# Altium schematic sheet Charger_BQ25713.SchDoc: Mynd-Charger
size A3; PageSetup: Record=PageOptions|CenterHorizontal=True|CenterVertical=True|PrintScale=0.71|XCorrection=1.00|YCorrection=1.00|PrintKind=0|BorderSize=5000000|LeftOffset=0|BottomOffset=0|Orientation=2|PaperLength=1000|PaperWidth=1000|Scale=100|PaperSource=7|PrintQuality=-3|MediaType=1|DitherType=10|PrintScaleMode=1|PaperKind=A4|PaperIndex=9; SheetNumber: 3; SheetTotal: 6
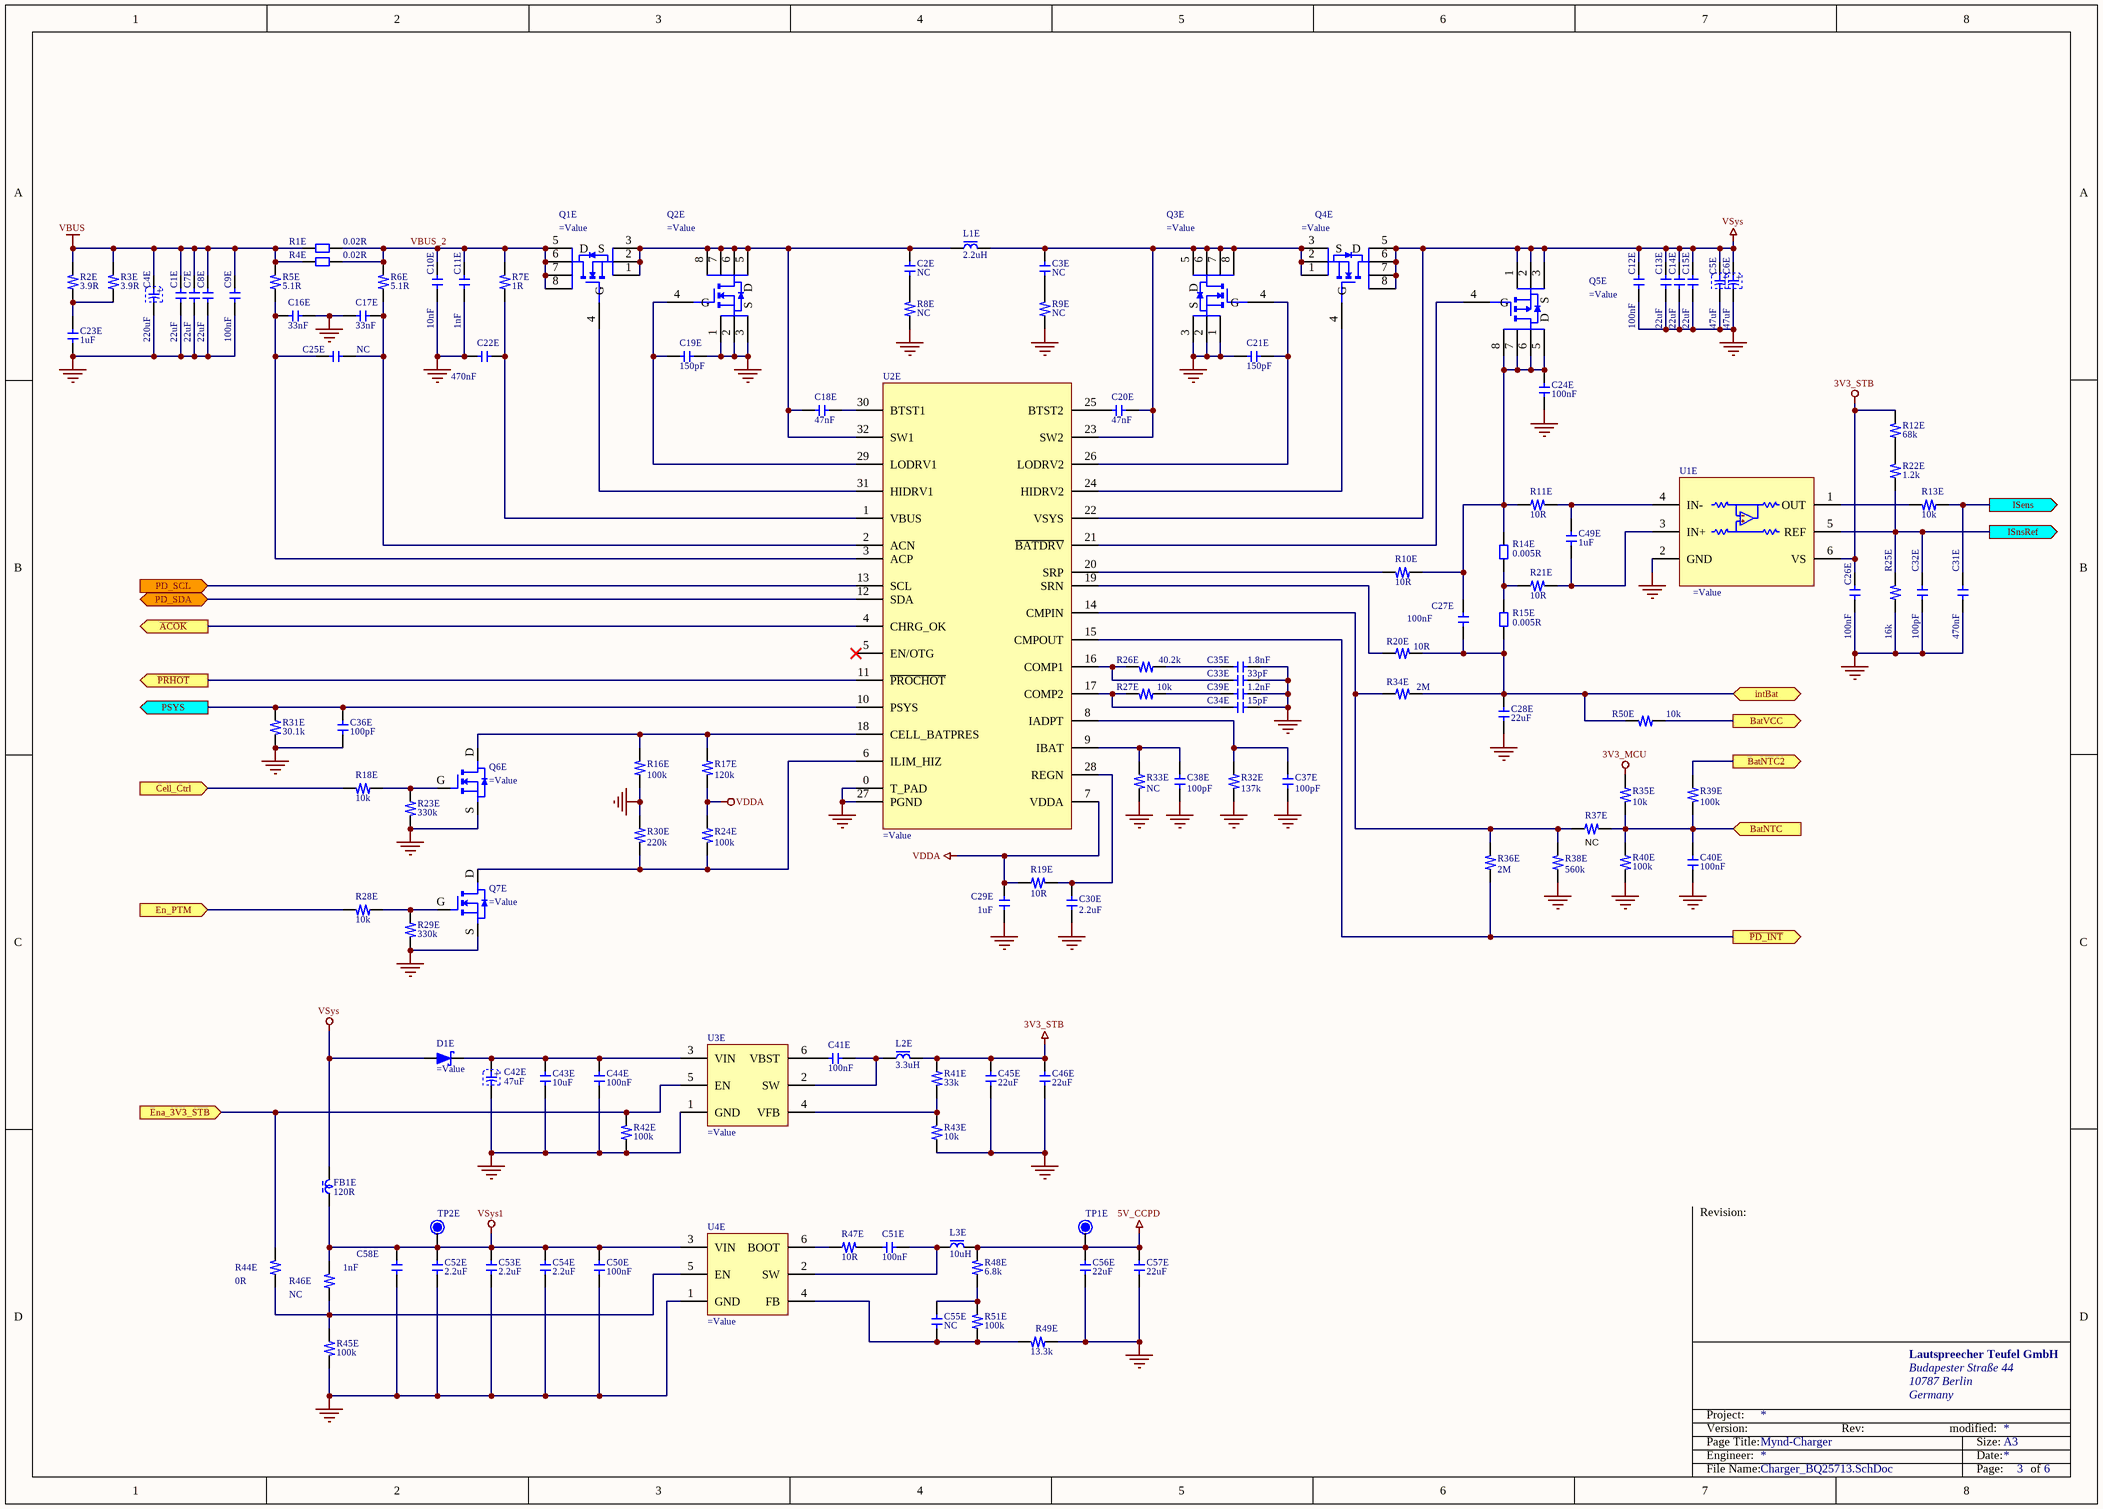
[diagram p0: Charger_BQ25713.SchDoc]

## Parts
C1E  22uF  [C1206]
C2E  NC  [C0603X80]
C3E  NC  [C0603X80]
C4E  220uF  [ECAP_SMD_800X1000]
C5E  47uF  [ECAP_SMD_630X540]
C6E  47uF  [ECAP_SMD_630X540]
C7E  22uF  [C1206]
C8E  22uF  [C1206]
C9E  100nF  [C0603X100]
C10E  10nF  [C0603X100]
C11E  1nF  [C0603X100]
C12E  100nF  [C0603X100]
C13E  22uF  [C1206]
C14E  22uF  [C1206]
C15E  22uF  [C1206]
C16E  33nF  [C0603X100]
C17E  33nF  [C0603X100]
C18E  47nF  [C0603X100]
C19E  150pF  [C0603X80]
C20E  47nF  [C0603X100]
C21E  150pF  [C0603X80]
C22E  470nF  [C0603X100]
C23E  1uF  [C0805_145]
C24E  100nF  [C0603X100]
C25E  NC  [C0603X100]
C26E  100nF  [C0603X100]
C27E  100nF  [C0603X100]
C28E  22uF  [C1206]
C29E  1uF  [C0603X105]
C30E  2.2uF  [C0603X105]
C31E  470nF  [C0603X100]
C32E  100pF  [C0603X80]
C33E  33pF  [C0603X80]
C34E  15pF  [C0603X80]
C35E  1.8nF  [C0603X100]
C36E  100pF  [C0603X80]
C37E  100pF  [C0603X80]
C38E  100pF  [C0603X80]
C39E  1.2nF  [C0402]
C40E  100nF  [C0603X100]
C41E  100nF  [C0603X100]
C42E  47uF  [ECAP_SMD_630X540]
C43E  10uF  [C1206]
C44E  100nF  [C0603X100]
C45E  22uF  [C0805_145]
C46E  22uF  [C0805_145]
C49E  1uF  [C0603X105]
C50E  100nF  [C0603X100]
C51E  100nF  [C0603X100]
C52E  2.2uF  [C0805_145]
C53E  2.2uF  [C0805_145]
C54E  2.2uF  [C0805_145]
C55E  NC  [C0603X80]
C56E  22uF  [C0805_145]
C57E  22uF  [C0805_145]
C58E  1nF  [C0603X105]
D1E  (no value)  [SOD-123]
FB1E  120R  [L0805]
L1E  2.2uH  [IND_SMD_YT_SQU_L118XW108XH40_A]
L2E  3.3uH  [IND_SMD_SQU_L60XW60XH20]
L3E  10uH  [IND_SMD_YT_SQU_L78XW70XH30]
Q1E  (no value)  [DFN8_500X600X100_127_A]
Q2E  (no value)  [DFN8_500X600X100_127_A]
Q3E  (no value)  [DFN8_500X600X100_127_A]
Q4E  (no value)  [DFN8_500X600X100_127_A]
Q5E  (no value)  [DFN8_500X600X100_127_A]
Q6E  (no value)  [SOT23-GSD]
Q7E  (no value)  [SOT23-GSD]
R1E  0.02R  [R1206]
R2E  3.9R  [R0805]
R3E  3.9R  [R0805]
R4E  0.02R  [R1206]
R5E  5.1R  [R0603]
R6E  5.1R  [R0603]
R7E  1R  [R0603]
R8E  NC  [R0805]
R9E  NC  [R0805]
R10E  10R  [R0603]
R11E  10R  [R0603]
R12E  68k  [R0603]
R13E  10k  [R0603]
R14E  0.005R  [R1206]
R15E  0.005R  [R1206]
R16E  100k  [R0603]
R17E  120k  [R0603]
R18E  10k  [R0603]
R19E  10R  [R0603]
R20E  10R  [R0603]
R21E  10R  [R0603]
R22E  1.2k  [R0603]
R23E  330k  [R0603]
R24E  100k  [R0603]
R25E  16k  [R0603]
R26E  40.2k  [R0603]
R27E  10k  [R0603]
R28E  10k  [R0603]
R29E  330k  [R0603]
R30E  220k  [R0603]
R31E  30.1k  [R0603]
R32E  137k  [R0603]
R33E  NC  [R0603]
R34E  2M  [R0603]
R35E  10k  [R0603]
R36E  2M  [R0603]
R37E  100k  [R0603]  (value not drawn)
R38E  560k  [R0603]
R39E  100k  [R0603]
R40E  100k  [R0603]
R41E  33k  [R0603]
R42E  100k  [R0603]
R43E  10k  [R0603]
R44E  0R  [R0603]
R45E  100k  [R0603]
R46E  NC  [R0603]
R47E  10R  [R0603]
R48E  6.8k  [R0603]
R49E  13.3k  [R0603]
R50E  10k  [R0603]
R51E  100k  [R0603]
TP1E  TP_T_60_40  [TP_T_60_40]  (value not drawn)  (no BOM)
TP2E  TP_T_60_40  [TP_T_60_40]  (value not drawn)  (no BOM)
U1E  (no value)  [SOT23_6_SC74]
U2E  (no value)  [QFN32_400X400X80_40_P280X280]
U3E  (no value)  [SOT23_6_SC74]
U4E  (no value)  [SOT23_6_SC74]

## Ports
BatNTC2 (out), BatNTC (in), BatVCC (out), Cell_Ctrl (in), En_PTM (in), Ena_3V3_STB (in), intBat (bidir), ISens (out), ISnsRef (out), PD_SCL (in), PD_SDA (bidir), PSYS (out), ~{ACOK} (out), ~{PD_INT} (out), ~{PRHOT} (out)

## Nets
3V3_MCU: R35E.2
3V3_STB: C26E.2 C45E.1 C46E.1 L2E.2 R12E.2 R41E.2 U1E.6(VS)
5V_CCPD: C56E.1 C57E.1 L3E.2 R48E.1 TP1E.1
GND: C1E.2 C4E.2 C5E.2 C6E.2 C7E.1 C8E.1 C9E.2 C10E.1 C11E.2 C12E.1 C13E.1 C14E.1 C15E.1 C16E.1 C17E.1 C19E.1 C21E.2 C22E.1 C23E.2 C24E.2 C26E.1 C28E.2 C29E.2 C30E.2 C31E.1 C32E.1 C33E.1 C34E.1 C35E.1 C36E.2 C37E.2 C38E.2 C39E.2 C40E.1 C42E.2 C43E.2 C44E.2 C45E.2 C46E.2 C50E.2 C52E.2 C53E.2 C54E.2 C56E.2 C57E.2 C58E.2 Q2E.1(S) Q2E.2(S) Q2E.3(S) Q3E.1(S) Q3E.2(S) Q3E.3(S) Q6E.S Q7E.S R8E.2 R9E.2 R16E.2 R23E.1 R25E.1 R29E.1 R30E.2 R31E.1 R32E.1 R33E.1 R38E.2 R40E.1 R42E.2 R43E.2 R45E.1 R49E.2 U1E.2(GND) U2E.0(T_PAD) U2E.27(PGND) U3E.1(GND) U4E.1(GND)
VBUS: C1E.1 C4E.1 C7E.2 C8E.2 C9E.1 R1E.1 R2E.1 R3E.1 R4E.1 R5E.1
VDDA: C29E.1 R17E.2 R19E.2 R24E.1 U2E.7(VDDA)
VSys: C5E.1 C6E.1 C12E.2 C13E.2 C14E.2 C15E.2 D1E.A FB1E.1 Q4E.5(D) Q4E.6(D) Q4E.7(D) Q4E.8(D) Q5E.1(S) Q5E.2(S) Q5E.3(S) U2E.22(VSYS)
VSys1: C50E.1 C52E.1 C53E.1 C54E.1 C58E.1 FB1E.2 R46E.1 TP2E.1 U4E.3(VIN)
~{ACOK}: U2E.4(CHRG_OK) ; port ~{ACOK}
~{PD_INT}: R36E.2 U2E.15(CMPOUT) ; port ~{PD_INT}
~{PRHOT}: U2E.11(~{PROCHOT}) ; port ~{PRHOT}
BatNTC: C40E.2 R35E.1 R37E.1 R39E.1 R40E.2 ; port BatNTC
BatNTC2: R39E.2 ; port BatNTC2
BatVCC: R50E.2 ; port BatVCC
Cell_Ctrl: R18E.1 ; port Cell_Ctrl
En_PTM: R28E.1 ; port En_PTM
Ena_3V3_STB: R42E.1 R44E.1 U3E.5(EN) ; port Ena_3V3_STB
intBat: C27E.2 C28E.1 R15E.1 R20E.1 R34E.1 R50E.1 ; port intBat
ISens: C31E.2 R13E.1 ; port ISens
ISnsRef: C32E.2 R22E.1 R25E.2 U1E.5(REF) ; port ISnsRef
PD_SCL: U2E.13(SCL) ; port PD_SCL
PD_SDA: U2E.12(SDA) ; port PD_SDA
PSYS: C36E.1 R31E.2 U2E.10(PSYS) ; port PSYS
VBUS_2: C10E.2 C11E.1 Q1E.5(D) Q1E.6(D) Q1E.7(D) Q1E.8(D) R1E.2 R4E.2 R6E.1 R7E.1
NetC2E_1: C2E.1 R8E.1
NetC2E_2: C2E.2 C18E.1 L1E.1 Q1E.1(S) Q1E.2(S) Q1E.3(S) Q2E.5(D) Q2E.6(D) Q2E.7(D) Q2E.8(D) U2E.32(SW1)
NetC3E_1: C3E.1 R9E.1
NetC3E_2: C3E.2 C20E.2 L1E.2 Q3E.5(D) Q3E.6(D) Q3E.7(D) Q3E.8(D) Q4E.1(S) Q4E.2(S) Q4E.3(S) U2E.23(SW2)
NetC16E_2: C16E.2 C25E.1 R5E.2 U2E.3(ACP)
NetC17E_2: C17E.2 C25E.2 R6E.2 U2E.2(ACN)
NetC18E_2: C18E.2 U2E.30(BTST1)
NetC19E_2: C19E.2 Q2E.4(G) U2E.29(LODRV1)
NetC20E_1: C20E.1 U2E.25(BTST2)
NetC21E_1: C21E.1 Q3E.4(G) U2E.26(LODRV2)
NetC22E_2: C22E.2 R7E.2 U2E.1(VBUS)
NetC23E_1: C23E.1 R2E.2 R3E.2
NetC24E_1: C24E.1 C27E.1 Q5E.5(D) Q5E.6(D) Q5E.7(D) Q5E.8(D) R10E.2 R11E.1 R14E.2
NetC30E_1: C30E.1 R19E.1 U2E.28(REGN)
NetC33E_2: C33E.2 R26E.2 U2E.16(COMP1)
NetC34E_2: C34E.2 R27E.1 U2E.17(COMP2)
NetC35E_2: C35E.2 R26E.1
NetC37E_1: C37E.1 R32E.2 U2E.8(IADPT)
NetC38E_1: C38E.1 R33E.2 U2E.9(IBAT)
NetC39E_1: C39E.1 R27E.2
NetC41E_1: C41E.1 U3E.6(VBST)
NetC41E_2: C41E.2 L2E.1 U3E.2(SW)
NetC42E_1: C42E.1 C43E.1 C44E.1 D1E.K U3E.3(VIN)
NetC49E_1: C49E.1 R11E.2 U1E.4(IN-)
NetC49E_2: C49E.2 R21E.1 U1E.3(IN+)
NetC51E_1: C51E.1 L3E.1 U4E.2(SW)
NetC51E_2: C51E.2 R47E.1
NetC55E_1: C55E.1 R48E.2 R51E.1
NetC55E_2: C55E.2 R49E.1 R51E.2 U4E.4(FB)
NetQ1E_4: Q1E.4(G) U2E.31(HIDRV1)
NetQ4E_4: Q4E.4(G) U2E.24(HIDRV2)
NetQ5E_4: Q5E.4(G) U2E.21(~{BATDRV})
NetQ6E_D: Q6E.D R16E.1 R17E.1 U2E.18(CELL_BATPRES)
NetQ6E_G: Q6E.G R18E.2 R23E.2
NetQ7E_D: Q7E.D R24E.2 R30E.1 U2E.6(ILIM_HIZ)
NetQ7E_G: Q7E.G R28E.2 R29E.2
NetR10E_1: R10E.1 U2E.20(SRP)
NetR12E_1: R12E.1 R22E.2
NetR13E_2: R13E.2 U1E.1(OUT)
NetR14E_1: R14E.1 R15E.2 R21E.2
NetR20E_2: R20E.2 U2E.19(SRN)
NetR34E_2: R34E.2 R36E.1 R37E.2 R38E.1 U2E.14(CMPIN)
NetR41E_1: R41E.1 R43E.1 U3E.4(VFB)
NetR44E_2: R44E.2 R45E.2 R46E.2 U4E.5(EN)
NetR47E_2: R47E.2 U4E.6(BOOT)

Not connected (* = marked no-connect by the designer): U2E 5(EN/OTG)*

## Notes on the sheet
- (near R37E) NC
- Revision:
- Lautspreecher Teufel GmbH
- Budapester Straße 44
- 10787 Berlin
- Germany
- Page Title:
- Engineer:
- Project:
- Version:
- Rev:
- modified:
- Date:
- Size:
- A3
- File Name:
- Page:
- of
- (in symbol P-001-0142-39) +
- (in symbol P-001-0307-14) +
- (in symbol P-001-0307-15) +

## Library data of the parts
C1E C7E C8E C13E C14E C15E C28E = P-001-0195-15: PSHF SMD M CAP 22uF 25V ±20% 1206 X5R; Manufacturer: Multi Sourced; Part_Number: Generic; Part_Type: Capacitor ceramic SMT; Tolerance: ±20%; TemperatureRange: X5R; Value: 22uF; Temp_Coefficient: X5R; Voltage: 25V
C2E C3E = P-001-0381-16: PSHF SMD M CAP 30pF 50V ±5% 0603 NPO; Manufacturer: Multi Sourced; Part_Number: Generic; Part_Type: Capacitor ceramic SMT; Tolerance: ±5%; TemperatureRange: NPO; Value: NC; Temp_Coefficient: NPO; Voltage: 50V
C4E = P-001-0142-39: PS SMD COND ELECT 220uF 35V ±20% 105℃; Manufacturer: Multi-Sourced; Part_Number: Generic; Part_Type: Capacitor electrolytic SMT; Tolerance: ±20%; TemperatureRange: 105℃; Value: 220uF; Voltage: 35V
C5E C6E = P-001-0307-14: PS SMD COND ELECT 47uF 35V ±20% 105℃; Manufacturer: Multi-Sourced; Part_Number: Generic; Part_Type: Capacitor electrolytic SMT; Tolerance: ±20%; TemperatureRange: 105℃; Value: 47uF; Voltage: 35V
C9E C12E C24E C26E C27E C40E C41E C44E C50E C51E = P-001-0074-61: PSHF SMD M CAP 100nF 50V ±10% 0603 X7R; Manufacturer: Multi Sourced; Part_Number: Generic; Part_Type: Capacitor ceramic SMT; Tolerance: ±10%; TemperatureRange: X7R; Value: 100nF; Temp_Coefficient: X7R; Voltage: 50V
C10E C25E = P-001-0058-45: PSHF SMD M CAP 10nF 50V ±10% 0603 X7R; Manufacturer: Multi Sourced; Part_Number: Generic; Part_Type: Capacitor ceramic SMT; Tolerance: ±10%; TemperatureRange: X7R; Temp_Coefficient: X7R; Voltage: 50V
  C10E: Value: 10nF
  C25E: Value: NC
C11E = P-001-0073-48: PSHF SMD M CAP 1nF 50V ±10% 0603 X7R; Manufacturer: Multi Sourced; Part_Number: Generic; Part_Type: Capacitor ceramic SMT; Tolerance: ±10%; TemperatureRange: X7R; Value: 1nF; Temp_Coefficient: X7R; Voltage: 50V
C16E C17E = P-001-0095-32: PSHF SMD M CAP 33nF 50V ±10% 0603 X7R; Manufacturer: Multi Sourced; Part_Number: Generic; Part_Type: Capacitor ceramic SMT; Tolerance: ±10%; TemperatureRange: X7R; Value: 33nF; Temp_Coefficient: X7R; Voltage: 50V
C18E C20E = P-001-0094-25: PSHF SMD M CAP 47nF 50V ±10% 0603 X7R; Manufacturer: Multi Sourced; Part_Number: Generic; Part_Type: Capacitor ceramic SMT; Tolerance: ±10; TemperatureRange: X7R; Value: 47nF; Temp_Coefficient: X7R; Voltage: 50V
C19E C21E = P-001-0063-16: PSHF SMD M CAP 150pF 50V ±10% 0603 X7R; Manufacturer: Multi Sourced; Part_Number: Generic; Part_Type: Capacitor ceramic SMT; Tolerance: ±10%; TemperatureRange: X7R; Value: 150pF; Temp_Coefficient: X7R; Voltage: 50V
C22E = P-001-0125-21: PSHF SMD M CAP 470nF 50V ±10% 0603 X7R; Manufacturer: Multi Sourced; Part_Number: Generic; Part_Type: Capacitor ceramic SMT; Tolerance: ±10%; TemperatureRange: X7R; Value: 470nF; Temp_Coefficient: X7R; Voltage: 50V
C23E = P-001-0174-47: PSHF SMD M CAP 1uF 50V ±10% 0805 X7R; Manufacturer: Multi Sourced; Part_Number: Generic; Part_Type: Capacitor ceramic SMT; Tolerance: ±10%; TemperatureRange: X7R; Value: 1uF; Temp_Coefficient: X7R; Voltage: 50V
C29E = P-001-0065-40: PSHF SMD M CAP 1uF 50V ±10% 0603 X7R; Manufacturer: Multi Sourced; Part_Number: Generic; Part_Type: Capacitor ceramic SMT; Tolerance: ±10%; TemperatureRange: X7R; Value: 1uF; Temp_Coefficient: X7R; Voltage: 50V
C30E = P-001-0424-41: PSHF SMD M CAP 2.2uF 25V ±10% 0603 X5R; Manufacturer: Multi Sourced; Part_Number: Generic; Part_Type: Capacitor ceramic SMT; Tolerance: ±10%; TemperatureRange: X5R; Value: 2.2uF; Temp_Coefficient: X5R; Voltage: 25V
C31E = P-001-0012-32: GPHF SMD M CAP 470nF 50V ±10% 0603 X5R; Manufacturer: Multi Sourced; Part_Number: Generic; Part_Type: Capacitor ceramic SMT; Tolerance: ±10%; TemperatureRange: X5R; Value: 470nF; Temp_Coefficient: X5R; Voltage: 50V
C32E C36E C37E C38E = P-001-0637-10: PSHF SMD M CAP 100pF 50V ±10% 0603 X7R; Manufacturer: Multi Sourced; Part_Number: Generic; Part_Type: Capacitor ceramic SMT; Tolerance: ±10%; TemperatureRange: X7R; Value: 100pF; Temp_Coefficient: X7R; Voltage: 50V
C33E = P-001-0394-18: PSHF SMD M CAP 33pF 50V ±5% 0603 NPO; Manufacturer: Multi Sourced; Part_Number: Generic; Part_Type: Capacitor ceramic SMT; Tolerance: ±5%; TemperatureRange: NPO; Value: 33pF; Temp_Coefficient: NPO; Voltage: 50V
C34E C55E = P-001-0639-12: PSHF SMD M CAP 15pF 50V ±5% 0603 NPO; Manufacturer: Multi Sourced; Part_Number: Generic; Part_Type: Capacitor ceramic SMT; Tolerance: ±5%; TemperatureRange: NPO; Temp_Coefficient: NPO; Voltage: 50V
  C34E: Value: 15pF
  C55E: Value: NC
C35E = P-001-0076-17: PSHF SMD M CAP 1.8nF 50V ±10% 0603 X7R; Manufacturer: Multi Sourced; Part_Number: Generic; Part_Type: Capacitor ceramic SMT; Tolerance: ±10%; TemperatureRange: X7R; Value: 1.8nF; Temp_Coefficient: X7R; Voltage: 50V
C39E = P-001-0346-18: PSHF SMD M CAP 1.2nF 50V ±10% 0402 X7R; Manufacturer: Multi Sourced; Part_Number: Generic; Part_Type: Capacitor ceramic SMT; Tolerance: ±10%; TemperatureRange: X7R; Value: 1.2nF; Temp_Coefficient: X7R; Voltage: 50V
C42E = P-001-0307-15: PS SMD COND ELECT 47uF 35V ±20% 105℃; Manufacturer: Multi-Sourced; Part_Number: Generic; Part_Type: Capacitor electrolytic SMT; Tolerance: ±20%; TemperatureRange: 105℃; Value: 47uF; Voltage: 35V
C43E = P-001-0200-18: PSHF SMD M CAP 10uF 50V ±10% 1206 X5R; Manufacturer: Multi Sourced; Part_Number: Generic; Part_Type: Capacitor ceramic SMT; Tolerance: ±10%; TemperatureRange: X5R; Value: 10uF; Temp_Coefficient: X5R; Voltage: 50V
C45E C46E C56E C57E = P-001-0128-57: PSHF SMD M CAP 22uF 10V ±20% 0805 X5R; Manufacturer: Multi Sourced; Part_Number: Generic; Part_Type: Capacitor ceramic SMT; Tolerance: ±20%; TemperatureRange: X5R; Value: 22uF; Temp_Coefficient: X5R; Voltage: 10V
C49E = P-001-0065-43: GPHF SMD M CAP 1uF 50V ±10% 0603 X7R; Manufacturer: Multi Sourced; Part_Number: Generic; Part_Type: Capacitor ceramic SMT; Tolerance: ±10%; TemperatureRange: X7R; Value: 1uF; Temp_Coefficient: X7R; Voltage: 50V
C52E C53E C54E = P-001-0127-40: PSHF SMD M CAP 2.2uF 50V ±10% 0805 X5R; Manufacturer: Multi Sourced; Part_Number: Generic; Part_Type: Capacitor ceramic SMT; Tolerance: ±10%; TemperatureRange: X5R; Value: 2.2uF; Temp_Coefficient: X5R; Voltage: 50V
C58E = P-001-0827-3: SMD M CAP 1nF 250V ±10% 0603 X7R; Manufacturer: Multi Sourced; Part_Number: Generic; Part_Type: Capacitor ceramic SMT; Tolerance: ±10%; TemperatureRange: X7R; Value: 1nF; Temp_Coefficient: X7R; Voltage: 250V
D1E = R-001-0072-13: PS SMD DIODE 2P SOD-123 B5819W CJ; Manufacturer: [CJ]; Part_Type: Semiconductor Diode SMT; Current: 1A; Voltage: 40V; Value: B5819W; Part_Number: B5819W
FB1E = S-001-0018-20: GPHF SMD BEAD 120 OHM 5A 25% 0805; Manufacturer: Tai-Tech; Part_Number: HCB2012KF-121T50; Part_Type: Ferrite Bead SMT; Tolerance: 1:25%; Frequency: 100MHz; Current: 5A; Value: 120R
L1E = S-001-0101-15: SMD INDUCTOR 2.2μH NORM; Manufacturer: [CET CHAMPIONS]; Part_Number: CET1040H-2R2M-PZY; Part_Type: Inductor SMT; Current: 12.2A; Tolerance: 7:20%; Value: 2.2uH
L2E = S-001-0415-2: SMD INDUCTOR 3.3μH 100KHz NORM; Manufacturer: TSA; Part_Number: SNR6020B-3R3NT; Part_Type: Inductor SMT; Current: 3.15A; Tolerance: 7:20%; Frequency: 100KHz; Value: 3.3uH
L3E = S-001-0042-38: GP SMD INDUCTOR 10uH 1MHz 1V NORM; Manufacturer: [CHAMPIONS]; Part_Number: CET0630T-100M-B; Part_Type: Inductor SMT; Current: 4A; Tolerance: 7:20%; Voltage: 1V; Frequency: 1MHz; Value: 10uH
Q1E Q2E Q3E Q4E = R-001-0189-22: PSHF SMD FET 8P DFN8 AP4024GEMT-HF APEC; Part_Type: Semiconductor Transistor SMT; Current: 60A; Voltage: 30V; Manufacturer: APEC; Value: AP4024GEMT-HF; Part_Number: AP4024GEMT-HF
Q5E = R-001-1697-3: SMD FET 8P 30V PDFN5X6 SSC8039GN6 SSC; Part_Type: Semiconductor Transistor SMT; Current: 64A; Voltage: 30; Manufacturer: SSC; Value: SSC8039GN6; Part_Number: SSC8039GN6
Q6E Q7E = R-001-0217-29: GP SMD FET 3P SOT23 2N7002K CTE; Part_Type: Semiconductor Transistor SMT; Current: 300MA; Voltage: 60V; Manufacturer: CTE; Value: 2N7002K; Part_Number: 2N7002K
R1E R4E = Q-001-0995-2: SMD METAL FILM RES. 20mohm 1W 1% 1206 WALTER; Part_Number: STE1206M1W0R020FS; Part_Type: Resistor SMT; Temp_Coefficient: 150ppm; Tolerance: 1%; Manufacturer: WALTER; Wattage: 1W; Value: 0.02R
R2E R3E = Q-001-0994-2: SMD RES. 3.9Ohm 1/8W 1% 0805; Part_Type: Resistor SMT; Manufacturer: Multi-Sourced; Part_Number: Generic; Temp_Coefficient: 150ppm; Tolerance: 1%; Value: 3.9R; Wattage: 1/8W
R5E R6E = Q-001-0487-19: PS SMD RES. 5.1OHM 1/10W 1% 0603; Part_Type: Resistor SMT; Manufacturer: Multi-Sourced; Part_Number: Generic; Temp_Coefficient: 150ppm; Tolerance: 1%; Value: 5.1R; Wattage: 1/10W
R7E = Q-001-0416-22: PS SMD RES. 1Ohm 1/10W 1% 0603; Part_Type: Resistor SMT; Manufacturer: Multi-Sourced; Part_Number: Generic; Temp_Coefficient: 150ppm; Tolerance: 1%; Value: 1R; Wattage: 1/10W
R8E R9E = Q-001-0191-17: PS SMD RES. 56OHM 1/8W 5% 0805; Manufacturer: Multi-Sourced; Part_Number: Generic; Part_Type: Resistor SMT; Temp_Coefficient: 150ppm; Tolerance: 5%; Wattage: 1/8W; Value: NC
R10E R19E R20E R47E = Q-001-0043-23: PS SMD RES. 10OHM 1/10W 1% 0603; Part_Type: Resistor SMT; Manufacturer: Multi-Sourced; Part_Number: Generic; Temp_Coefficient: 150ppm; Tolerance: 1%; Value: 10R; Wattage: 1/10W
R11E R21E = Q-001-0043-26: GPHF SMD RES. 10OHM 1/10W 1% 0603; Manufacturer: Multi-Sourced; Part_Number: Generic; Part_Type: Resistor SMT; Temp_Coefficient: 150ppm; Tolerance: 1%; Wattage: 1/10W; Value: 10R
R12E = Q-001-0485-23: PS SMD RES. 68KOHM 1/10W 1% 0603; Part_Type: Resistor SMT; Manufacturer: Multi-Sourced; Part_Number: Generic; Temp_Coefficient: 150ppm; Tolerance: 1%; Value: 68k; Wattage: 1/10W
R13E R18E R27E R28E R35E R43E R50E = Q-001-0036-48: PS SMD RES. 10KOHM 1/10W 1% 0603; Part_Type: Resistor SMT; Manufacturer: Multi-Sourced; Part_Number: Generic; Temp_Coefficient: 150ppm; Tolerance: 1%; Value: 10k; Wattage: 1/10W
R14E R15E = Q-001-0993-3: SMD METAL FILM RES. 5mohm 1W 1% 1206 WALTER; Part_Number: STE1206M1W0R005FS; Part_Type: Resistor SMT; Temp_Coefficient: 150ppm; Tolerance: 1%; Manufacturer: WALTER; Wattage: 1W; Value: 0.005R
R16E R24E R33E R40E R42E = Q-001-0032-53: PS SMD RES. 100KOHM 1/10W 1% 0603; Part_Type: Resistor SMT; Manufacturer: Multi-Sourced; Part_Number: Generic; Temp_Coefficient: 150ppm; Tolerance: 1%; Wattage: 1/10W
  R16E R24E R40E R42E: Value: 100k
  R33E: Value: NC
R17E = Q-001-0893-8: PS SMD RES. 120Kohm 1/10W 1% 0603; Part_Type: Resistor SMT; Manufacturer: Multi-Sourced; Part_Number: Generic; Temp_Coefficient: 150ppm; Tolerance: 1%; Value: 120k; Wattage: 1/10W
R22E = Q-001-0265-28: PS SMD RES. 1.2KOHM 1/10W 1% 0603; Part_Type: Resistor SMT; Manufacturer: Multi-Sourced; Part_Number: Generic; Temp_Coefficient: 150ppm; Tolerance: 1%; Value: 1.2k; Wattage: 1/10W
R23E R29E = Q-001-0378-19: PS SMD RES. 330KOHM 1/10W 1% 0603; Part_Type: Resistor SMT; Manufacturer: Multi-Sourced; Part_Number: Generic; Temp_Coefficient: 150ppm; Tolerance: 1%; Value: 330k; Wattage: 1/10W
R25E = Q-001-0313-27: GPHF SMD RES. 16KOHM 1/10W 1% 0603; Manufacturer: Multi-Sourced; Part_Number: Generic; Part_Type: Resistor SMT; Temp_Coefficient: 150ppm; Tolerance: 1%; Wattage: 1/10W; Value: 16k
R26E = Q-001-0990-2: SMD RES. 40.2KOhm 1/10W 1% 0603; Part_Type: Resistor SMT; Manufacturer: Multi-Sourced; Part_Number: Generic; Temp_Coefficient: 150ppm; Tolerance: 1%; Value: 40.2k; Wattage: 1/10W
R30E = Q-001-0703-20: PS SMD RES. 220KOHM 1/10W 1% 0603; Part_Type: Resistor SMT; Manufacturer: Multi-Sourced; Part_Number: Generic; Temp_Coefficient: 150ppm; Tolerance: 1%; Value: 220k; Wattage: 1/10W
R31E = Q-001-0390-19: PS SMD RES. 30.1KOHM 1/10W 1% 0603; Part_Type: Resistor SMT; Manufacturer: Multi-Sourced; Part_Number: Generic; Temp_Coefficient: 150ppm; Tolerance: 1%; Value: 30.1k; Wattage: 1/10W
R32E = Q-001-0986-2: SMD RES. 137KOhm 1/10W 1% 0603; Part_Type: Resistor SMT; Manufacturer: Multi-Sourced; Part_Number: Generic; Temp_Coefficient: 150ppm; Tolerance: 1%; Value: 137k; Wattage: 1/10W
R34E R36E = Q-001-0421-14: PS SMD RES. 2Mohm 1/10W 1% 0603; Part_Type: Resistor SMT; Manufacturer: Multi-Sourced; Part_Number: Generic; Temp_Coefficient: 150ppm; Tolerance: 1%; Value: 2M; Wattage: 1/10W
R37E R39E R45E R46E R51E = Q-001-0032-53: PS SMD RES. 100KOHM 1/10W 1% 0603; Manufacturer: Multi-Sourced; Part_Number: Generic; Part_Type: Resistor SMT; Temp_Coefficient: 150ppm; Tolerance: 1%; Wattage: 1/10W
  R37E R39E R45E R51E: Value: 100k
  R46E: Value: NC
R38E = Q-001-0103-19: PS SMD RES. 560KOHM 1/10W 5% 0603; Part_Type: Resistor SMT; Manufacturer: Multi-Sourced; Part_Number: Generic; Tolerance: 1%; Temp_Coefficient: 150ppm; Value: 560k; Wattage: 1/10W
R41E = Q-001-0388-42: PS SMD RES. 33KOHM 1/10W 1% 0603; Manufacturer: Multi-Sourced; Part_Number: Generic; Part_Type: Resistor SMT; Temp_Coefficient: 150ppm; Tolerance: 1%; Wattage: 1/10W; Value: 33k
R44E = Q-001-0048-199: PS SMD RES. 0OHM 1/10W 5% 0603; Part_Type: Resistor SMT; Manufacturer: Multi-Sourced; Part_Number: Generic; Tolerance: 1%; Temp_Coefficient: 150ppm; Value: 0R; Wattage: 1/10W
R48E = Q-001-0483-22: GPHF SMD RES. 6.8KOHM 1/10W 1% 0603; Manufacturer: Multi-Sourced; Part_Number: Generic; Part_Type: Resistor SMT; Temp_Coefficient: 150ppm; Tolerance: 1%; Wattage: 1/10W; Value: 6.8k
R49E = Q-001-0312-26: PS SMD RES. 13.3KOHM 1/10W 1% 0603; Manufacturer: Multi-Sourced; Part_Number: Generic; Part_Type: Resistor SMT; Temp_Coefficient: 150ppm; Tolerance: 1%; Wattage: 1/10W; Value: 13.3k
TP1E TP2E = CMP-00089-1: Test Point; Design Item ID: TP
U1E = R-001-1947-2: SMD IC 6P SOT-23 INA181A1IDBVR TI; Part_Type: Semiconductor Integrated Circuit SMT; Manufacturer: TI; Part_Number: INA181A1IDBVR; Value: INA181A1IDBVR
U2E = R-001-0379-14: GP SMD IC 32P WQFN BQ25713RSNR TI; Manufacturer: [TI]; Part_Type: Semiconductor Integrated Circuit SMT; Part_Number: BQ25713RSNR; Value: BQ25713RSNR
U3E = R-001-0804-28: GP SMD IC 6P SOT-23 TPS562201DDCR TI; Manufacturer: [TI]; Part_Type: Semiconductor Integrated Circuit SMT; Part_Number: TPS562201DDCR; Value: TPS562201DDCR
U4E = R-001-1009-19: GP SMD IC 6P SOP-23 TPS54302DDCR TI; Manufacturer: [TI]; Part_Type: Semiconductor Integrated Circuit SMT; Part_Number: TPS54302DDCR; Value: TPS54302DDCR